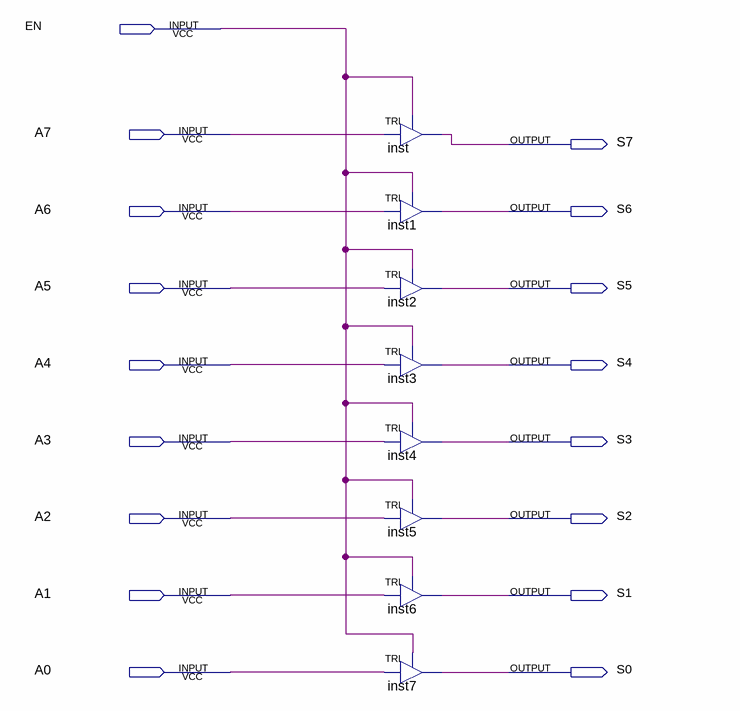
[diagram p0: schematic sheet]
// Quartus schematic Buffers_TriState_8.bdf as structural Verilog: 8 symbols, 17 pins
module Buffers_TriState_8 (
  input  EN,
  input  A7,
  input  A6,
  input  A5,
  input  A4,
  input  A3,
  input  A2,
  input  A1,
  input  A0,
  output S7,
  output S6,
  output S5,
  output S4,
  output S3,
  output S2,
  output S1,
  output S0
);

  TRI inst (.IN(A7), .OE(EN), .OUT(S7));
  TRI inst1 (.IN(A6), .OE(EN), .OUT(S6));
  TRI inst2 (.IN(A5), .OE(EN), .OUT(S5));
  TRI inst3 (.IN(A4), .OE(EN), .OUT(S4));
  TRI inst4 (.IN(A3), .OE(EN), .OUT(S3));
  TRI inst5 (.IN(A2), .OE(EN), .OUT(S2));
  TRI inst6 (.IN(A1), .OE(EN), .OUT(S1));
  TRI inst7 (.IN(A0), .OE(EN), .OUT(S0));
endmodule
